# EAGLE design pmod-usb-raw (EAGLE 9.0.0)
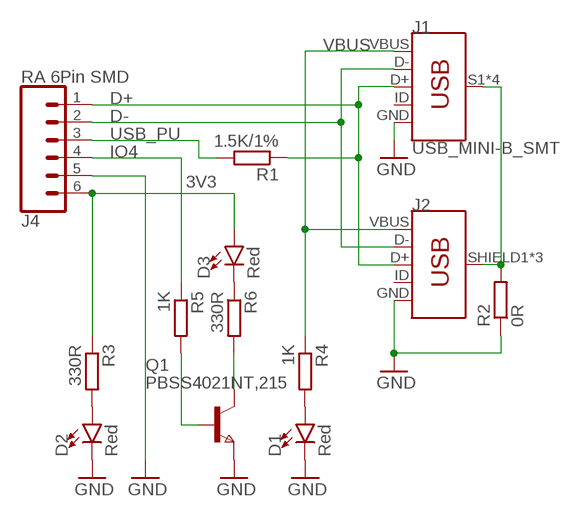
[diagram p0: schematic, sheet 1]

## Parts
D1  Red  LED-RED0603-SMART  [LED-0603]
D2  Red  LED-RED0603-SMART  [LED-0603]
D3  Red  LED-RED0603-SMART  [LED-0603]
J1  USB_MINI-B_SMT  [USB-MINIB]
J2  USB_MICRO-B_FEMALE-SMT  [USB-B-MICRO-SMD]
J4  RA 6Pin SMD  CONN_06SMD  [1X06-SMD_RA_MALE]
Q1  PBSS4021NT,215  [SOT23]
R1  1.5K/1%  R-EU_R0603  [R0603]
R2  0R  R-EU_R0603  [R0603]
R3  330R  R-EU_R0603  [R0603]
R4  1K  R-EU_R0603  [R0603]
R5  1K  R-EU_R0603  [R0603]
R6  330R  R-EU_R0603  [R0603]

## Nets
3V3: D3.A J4.6 R3.1
D+: J1.D+ J2.D+ J4.1 R1.1
D-: J1.D- J2.D- J4.2
GND: D1.C D2.C J1.GND J2.GND J4.5 Q1.2(E) R2.1
IO4: J4.4 R5.1
N$2: D2.A R3.2
N$3: D1.A R4.2
N$5: Q1.1(B) R5.2
N$6: D3.C R6.1
N$7: Q1.3(C) R6.2
SHIELD: J1.S1(SHIELD) J1.S2(SHIELD) J1.S3(SHIELD) J1.S4(SHIELD) J2.SHIELD1(SHIELD) J2.SHIELD2(SHIELD) J2.SHIELD3(SHIELD) R2.2
USB_PU: J4.3 R1.2
VBUS: J1.VBUS J2.VBUS R4.1
Unconnected: J1.ID J2.ID

## Library data of the parts
D1-D3 = SparkFun-LED:LED-RED: Red SMD LED Used in manufacturing of most products at SparkFun Packages: 0603 - SMD 0603 package [Product Link] <http://docs.avagotech.com/docs/AV02-0551EN> 0603 SMART - SMD 0603 SMART package ( more efficient and expensive)[Product Link] <http://www.osram-os.com/Graphics/XPic2/00077099_0.pdf> 1206 - SMD1206 package [Product Link] <https://www.sparkfun.com/datasheets/DevTools/LilyPad/Q150OVS4.pdff> SparkFun Products: Pro Mini 328 -5V <https://www.sparkfun.com/products/821> RedBoard <https://www.sparkfun.com/products/12757> IOIO-OTG <https://www.sparkfun.com/products/13613>; PROD_ID: DIO-11154
J1 = SparkFun-Connectors:USB_MINI-B: USB type Mini-B Connector Breaks out 5th pin, and includes shield pins if needed. SparkFun Products: SparkFun FTDI Basic Breakout <https://www.sparkfun.com/products/9716> SparkFun XBee Explorer USB <https://www.sparkfun.com/products/11812> SparkFun Redboard <https://www.sparkfun.com/products/12757>; PROD_ID: CONN-08193; SF_ID: PRT-00587
J2 = SparkFun-Connectors:USB_MICRO-B: USB Type Micro-B Connector Male/female and PTH/SMT variants SparkFun Products: SparkFun microB USB Breakout <https://www.sparkfun.com/products/12035> SparkFun USB microB Plug Breakout <https://www.sparkfun.com/products/10031> SparkFun ESP8266 Thing <https://www.sparkfun.com/products/13231>; PROD_ID: CONN-11752
J4 = SparkFun-Connectors:CONN_06: Multi connection point. Often used as Generic Header-pin footprint for 0.1 inch spaced/style header connections On any of the 0.1 inch spaced packages, you can populate with these: Break Away Headers - Straight <https://www.sparkfun.com/products/116> (PRT-00116) Break Away Male Headers - Right Angle <https://www.sparkfun.com/products/553> (PRT-00553) Female Headers <https://www.sparkfun.com/products/115> (PRT-00115) Break Away Headers - Machine Pin <https://www.sparkfun.com/products/117> (PRT-00117) Break Away Female Headers - Swiss Machine Pin <https://www.sparkfun.com/products/743> (PRT-00743) Arduino Stackable Header - 6 Pin <https://www.sparkfun.com/products/9280> (PRT-09280) For SCREWTERMINALS and SPRING TERMINALS visit here: Screw Terimnals on SparkFun.com <https://www.sparkfun.com/search/results?term=Screw+Terminals> (5mm/3.5mm/2.54mm spacing) This device is also useful as a general connection point to wire up your design to another part of your project. Our various solder wires solder well into these plated through hole pads. Hook-Up Wire - Assortment (Stranded, 22 AWG) <https://www.sparkfun.com/products/11375> (PRT-11375) Hook-Up Wire - Assortment (Solid Core, 22 AWG) <https://www.sparkfun.com/products/11367> (PRT-11367) View the entire wire category on our website here <https://www.sparkfun.com/categories/141>; PROD_ID: CONN-08971
Q1 = semiconductors:PBSS4021NT,215
R1-R6 = rcl:R-EU_: RESISTOR, European symbol; SPICEPREFIX: R

## Board
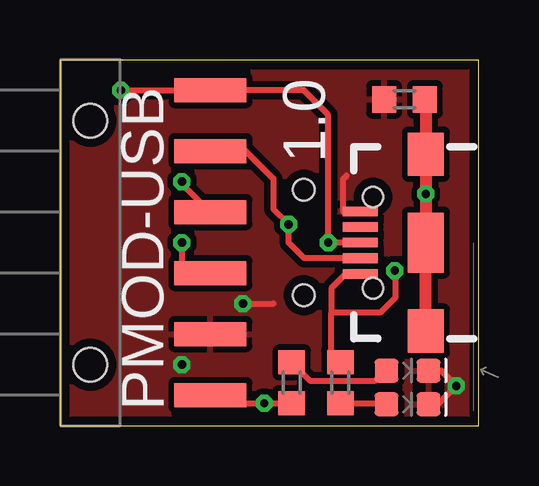
[diagram p1: board, top side]
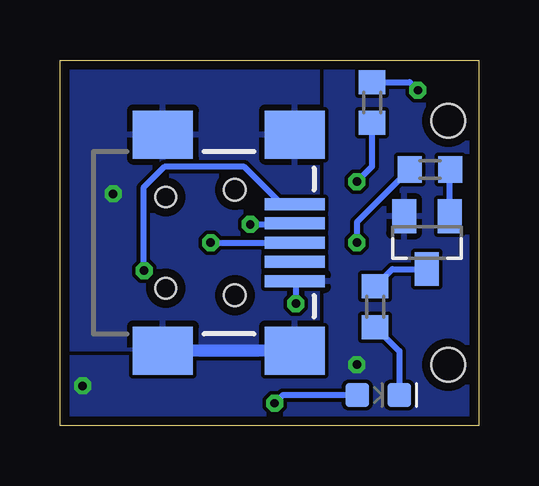
[diagram p2: board, bottom side, seen from below]

Size 17.45 x 15.23 mm. Coordinates in mm from the lower left corner, seen from the top.
Outline: 0,0 17.45,0 17.45,15.23 0,15.23 0,0
Copper layers (1*16): Top 0.0356mm / dielectric 1.5011mm / Bottom 0.0356mm
Design rules "laenpcborder": minimum track width 6mil, minimum drill 13mil, track to track 6mil, track to pad 6mil, pad to pad 6mil, via to via 6mil, smd to smd 6mil, copper to edge 15mil, drill to drill 6mil, minimum pad ring 7mil, minimum via ring 7mil, stop-mask expansion 4mil, vias tented up to drill 0mil, thermal gap 10mil

### Footprints (pad centres in the part's own frame; a part is rotated, then mirrored left to right if it is on the bottom)
LED-0603 = smd 1 x 1: A -0.877,0; C 0.877,0
USB-MINIB = smd 2.5 x 0.5: D+ 2.5,0; D- 2.5,0.8; GND 2.5,-1.6; ID 2.5,-0.8; VBUS 2.5,1.6 | smd 2.5 x 2: S1 -3,4.5; S2 2.5,4.5; S3 -3,-4.5; S4 2.5,-4.5 | hole 0.9: 0,2.2; 0,-2.2
USB-B-MICRO-SMD = smd 1.45 x 0.4: D+ 2.725,0; D- 2.725,0.65; GND 2.725,-1.3; ID 2.725,-0.65; VBUS 2.725,1.3 | smd 1.5 x 1.8: SHIELD1 0,3.685; SHIELD2 0,-3.685 | smd 1.5 x 2.5: SHIELD3 0,0 | hole 0.85: 2.2,1.9; 2.2,-1.9
1X06-SMD_RA_MALE = smd 1 x 3: 1 -6.35,5; 2 -3.81,5; 3 -1.27,5; 4 1.27,5; 5 3.81,5; 6 6.35,5 | hole 1.4: -5.08,0; 5.08,0
SOT23 = smd 1 x 1.4: 1 -0.95,-1.1; 2 0.95,-1.1; 3 0,1.1
R0603 = smd 1 x 1.1: 1 -0.85,0; 2 0.85,0

### Placement (x,y rotation side)
D1  14.48,0.89 0 top
D2  14.48,2.29 0 top
D3  4.19,1.27 0 bottom
J1  10.16,7.62 0 bottom
J2  15.24,7.62 180 top
J4  1.27,7.62 270 top
Q1  2.16,7.62 180 bottom
R1  4.45,13.46 270 bottom
R2  14.35,13.59 0 top
R3  9.65,1.78 90 top
R4  11.68,1.78 270 top
R5  2.03,10.67 0 bottom
R6  4.32,4.95 90 bottom

### Tracks (layer width: path | path; a pad name or v marks a point on that pad's centre or on a via)
3V3  (via drill 0.35)
  Top 0.254: R3.1 v8.51,0.93 6.61,0.93 6.31,1.23 J4.6
  Bottom 0.254: v8.51,0.93 8.17,1.27 D3.A
D+  (via drill 0.35)
  Top 0.254: v2.54,13.97 J4.1 10.16,13.97 11.18,12.95 v11.18,7.62 J2.D+
  Bottom 0.254: R1.1 2.88,14.31 v2.54,13.97 | v11.18,7.62 J1.D+
D-  (via drill 0.35)
  Top 0.254: J2.D- 10.18,6.97 9.53,7.62 v9.53,8.38 8.89,9.02 8.89,10.29 7.75,11.43 J4.2
  Bottom 0.254: v9.53,8.38 7.7,8.38 J1.D-
GND  (via drill 0.35)
  Top 0.254: D1.C 15.75,0.89 v16.51,1.65 15.88,2.29 D2.C | v7.62,5.08 8.89,5.08 | J2.GND 12.48,8.89 11.81,8.89 11.81,10.29 11.94,10.41
  Bottom 0.254: J1.GND 7.62,5.93 v7.62,5.08
  other vias: 5.08,2.54
  pour Top (isolate 0.254): 0,15.24 17.4,15.37 17.4,0.13 0,0
  pour Bottom: 0,15.24 6.35,15.24 6.35,2.79 17.53,2.79 17.53,0 0,0
IO4  (via drill 0.35)
  Top 0.254: v5.08,7.62 5.08,6.35 J4.4
  Bottom 0.254: R5.1 5.08,8.47 v5.08,7.62
N$2
  Top 0.254: D2.A 13.55,2.29 13.11,1.85 10.43,1.85 R3.2
N$3
  Top 0.254: R4.2 13.56,0.93 D1.A
N$5
  Bottom 0.254: Q1.1 1.21,10.64 R5.2
N$6
  Bottom 0.254: R6.1 3.31,3.1 D3.C
N$7
  Bottom 0.254: R6.2 3.6,6.52 Q1.3
SHIELD  (via drill 0.35)
  Top 0.508: R2.2 15.24,13.59 J2.SHIELD2 v15.24,9.65 J2.SHIELD3 J2.SHIELD1
  Bottom 0.508: J1.S4 J1.S3
  pour Bottom (rank 2): 6.35,15.24 17.4,15.24 17.4,0 6.35,0
USB_PU  (via drill 0.35)
  Top 0.254: J4.3 5.08,10.08 v5.08,10.16
  Bottom 0.254: v5.08,10.16 4.45,10.79 R1.2
VBUS  (via drill 0.35)
  Top 0.254: R4.1 11.56,2.79 11.3,3.05 11.3,4.7 | 11.3,4.7 11.3,5.71 11.91,6.32 J2.VBUS | v13.95,6.45 13.95,6.13 13.97,6.11 13.97,5.33 13.34,4.7 11.3,4.7
  Bottom 0.254: J1.VBUS 8.21,9.22 9.76,10.78 13.1,10.78 13.97,9.91 13.97,6.48 v13.95,6.45 | v13.95,6.45 13.84,6.35 v13.95,6.45

### Text on the board
tNames: 1.0 | PMOD-USB